# Altium schematic sheet QCopterFC__Sch.SchDoc
size A4; PageSetup: Record=PageOptions|CenterHorizontal=True|CenterVertical=True|PrintScale=1.00|XCorrection=1.00|YCorrection=1.00|PrintKind=0|BorderSize=5000000|LeftOffset=0|BottomOffset=0|Orientation=2|PaperLength=1000|PaperWidth=1000|Scale=100|PaperSource=7|PrintQuality=-4|MediaType=1|DitherType=10|PaperKind=A4|PrintScaleMode=1
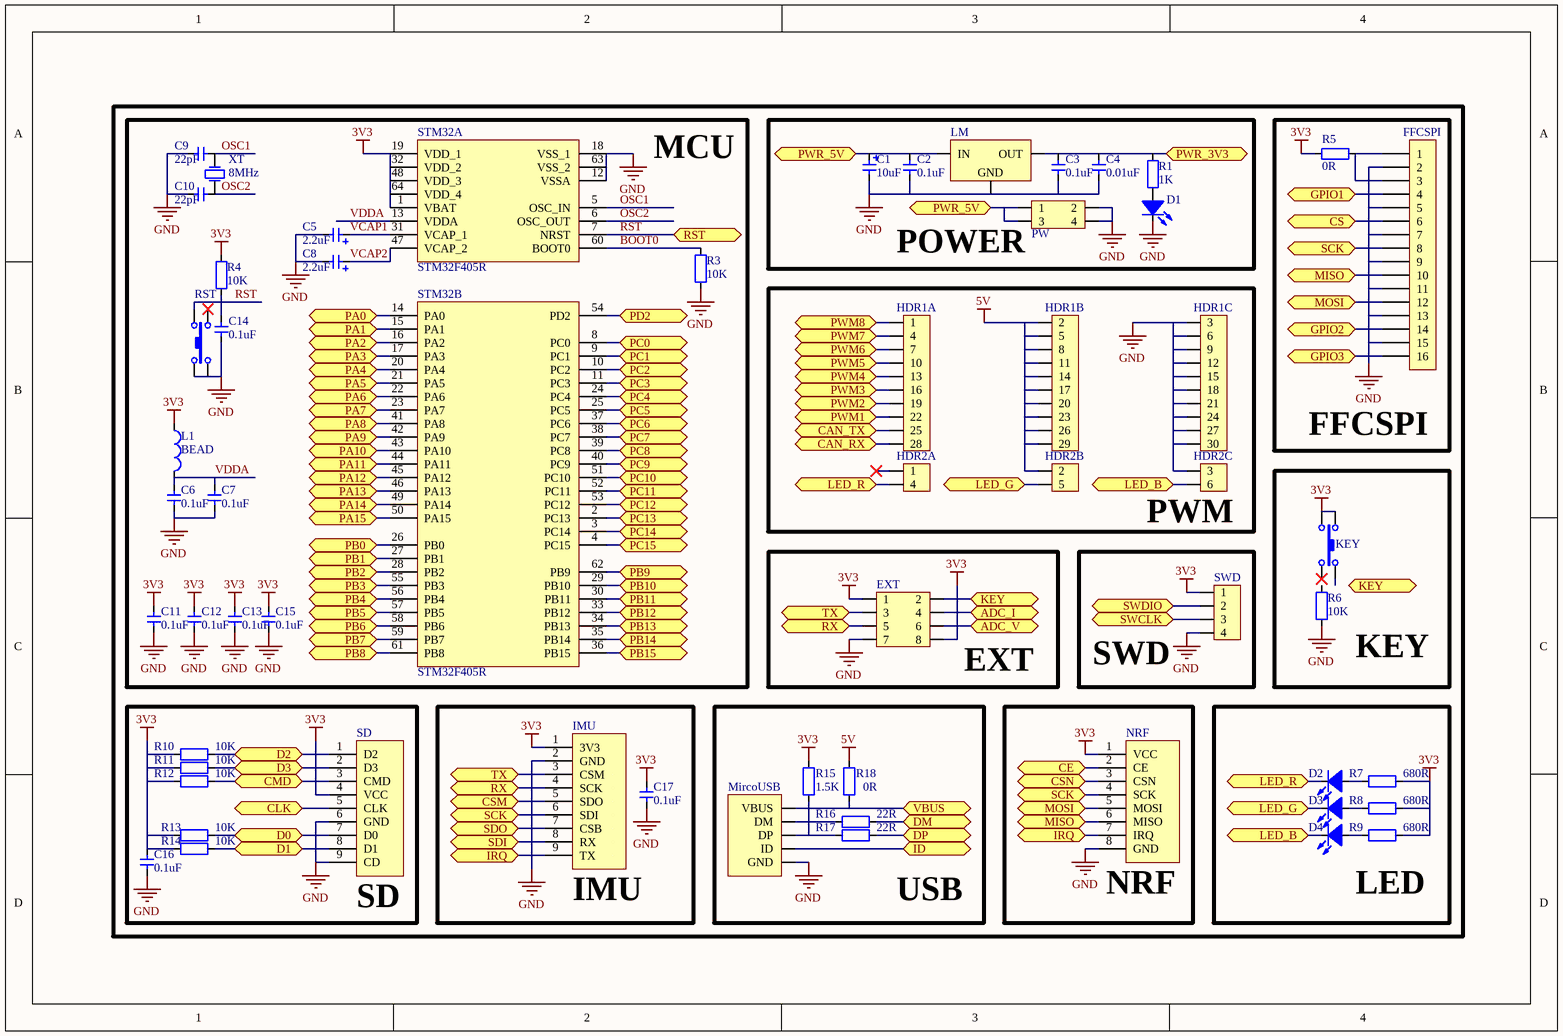
[diagram p0: QCopterFC__Sch.SchDoc]

## Parts
C1  value 10uF  [CAP_TAN_B1210]  (hidden comment: Cap_Tan_1210)
C2  value 0.1uF  [CAP_0603]  (hidden comment: Cap_0603)
C3  value 0.1uF  [CAP_0603]  (hidden comment: Cap_0603)
C4  value 0.01uF  [CAP_0603]  (hidden comment: Cap_0603)
C5  value 2.2uF  [CAP_TAN_P0805]  (hidden comment: Cap_Tan_0805)
C6  value 0.1uF  [CAP_0603]  (hidden comment: Cap_0603)
C7  value 0.1uF  [CAP_0603]  (hidden comment: Cap_0603)
C8  value 2.2uF  [CAP_TAN_P0805]  (hidden comment: Cap_Tan_0805)
C9  value 22pF  [CAP_0603]  (hidden comment: Cap_0603)
C10  value 22pF  [CAP_0603]  (hidden comment: Cap_0603)
C11  value 0.1uF  [CAP_0603]  (hidden comment: Cap_0603)
C12  value 0.1uF  [CAP_0603]  (hidden comment: Cap_0603)
C13  value 0.1uF  [CAP_0603]  (hidden comment: Cap_0603)
C14  value 0.1uF  [CAP_0603]  (hidden comment: Cap_0603)
C15  value 0.1uF  [CAP_0603]  (hidden comment: Cap_0603)
C16  value 0.1uF  [CAP_0603]  (hidden comment: Cap_0603)
C17  value 0.1uF  [CAP_0603]  (hidden comment: Cap_0603)
D1  LED_0603  [LED_0603_WHITE]  (value not drawn)
D2  LED_0603  [LED_0603_RED]  (value not drawn)
D3  LED_0603  [LED_0603_GREEN]  (value not drawn)
D4  LED_0603  [LED_0603_BLUE]  (value not drawn)
EXT  HDR2X4_90_2.54  [HDR2X4_90_2.54]  (value not drawn)
FFCSPI  FFC_0.5_16  [FFC_0.5_16]  (value not drawn)
HDR1  HDR3X10_90_2.54  [HDR3X10_90_2.54]  (value not drawn)  (parts A,B,C of 3)
HDR2  HDR3X2_90_2.54  [HDR3X2_90_2.54]  (value not drawn)  (parts A,B,C of 3)
IMU  SmartIMU  [SMART_IMU]  (value not drawn)
KEY  BT_TACT_3.5*5_90  [BT_TACT_3.5*3.55_90]  (value not drawn)
L1  value BEAD  [IND_0603]  (hidden comment: Ind_0603)
LM  LM1117  [SOT223]  (value not drawn)
MircoUSB  USB_Micro  [USB_Micro-AB]  (value not drawn)
NRF  nRF24L01P_PA_LNA  [NRF24L01P_PA_LNA]  (value not drawn)
PW  HDR2X2_90_2.54  [HDR2X2_90_2.54]  (value not drawn)
R1  value 1K  [RES_0603]  (hidden comment: Res_0603)
R3  value 10K  [RES_0603]  (hidden comment: Res_0603)
R4  value 10K  [RES_0603]  (hidden comment: Res_0603)
R5  value 0R  [RES_0603]  (hidden comment: Res_0603)
R6  value 10K  [RES_0603]  (hidden comment: Res_0603)
R7  value 680R  [RES_0603]  (hidden comment: Res_0603)
R8  value 680R  [RES_0603]  (hidden comment: Res_0603)
R9  value 680R  [RES_0603]  (hidden comment: Res_0603)
R10  value 10K  [RES_0603]  (hidden comment: Res_0603)
R11  value 10K  [RES_0603]  (hidden comment: Res_0603)
R12  value 10K  [RES_0603]  (hidden comment: Res_0603)
R13  value 10K  [RES_0603]  (hidden comment: Res_0603)
R14  value 10K  [RES_0603]  (hidden comment: Res_0603)
R15  value 1.5K  [RES_0603]  (hidden comment: Res_0603)
R16  value 22R  [RES_0603]  (hidden comment: Res_0603)
R17  value 22R  [RES_0603]  (hidden comment: Res_0603)
R18  value 0R  [RES_0603]  (hidden comment: Res_0603)
RST  BT_TACT_3.5*5_90  [BT_TACT_3.5*3.55_90]  (value not drawn)
SD  SD_Card_TF  [SD_Card_TF]  (value not drawn)
STM32  STM32F405R  [STM32_QFP64]  (parts A,B of 2)
SWD  HDR1X4_90F_2.54  [HDR1X4_90F_2.54]  (value not drawn)
XT  value 8MHz  [XTAL_5032]  (hidden comment: XTAL_5032_2P)

## Blocks framed on the sheet
MCU: C5-C15 L1 R3 R4 RST STM32 XT
POWER: C1-C4 D1 LM PW R1
FFCSPI: FFCSPI R5
PWM: HDR1 HDR2
KEY: KEY R6
SWD: SWD
IMU: C17 IMU
USB: MircoUSB R15-R18
NRF: NRF
LED: D2-D4 R7-R9

## Ports
ADC_I, ADC_V, CAN_RX, CAN_TX, CE, CLK, CMD, CS, CSM, CSN, D0, D1, D2, D3, DM, DP, GPIO1, GPIO2, GPIO3, ID, IRQ, KEY, LED_B, LED_G, LED_R, MISO, MOSI, PA0, PA1, PA2, PA3, PA4, PA5, PA6, PA7, PA8, PA9, PA10, PA11, PA12, PA13, PA14, PA15, PB0, PB1, PB2, PB3, PB4, PB5, PB6, PB7, PB8, PB9, PB10, PB11, PB12, PB13, PB14, PB15, PC0, PC1, PC2, PC3, PC4, PC5, PC6, PC7, PC8, PC9, PC10, PC11, PC12, PC13, PC14, PC15, PD2, PWM1, PWM2, PWM3, PWM4, PWM5, PWM6, PWM7, PWM8, PWR_3V3, PWR_5V, RST, RX, SCK, SDI, SDO, SWCLK, SWDIO, TX, VBUS

## Nets
3V3: C11.1 C12.1 C13.1 C15.1 C16.2 C17.2 EXT.1 EXT.8 IMU.1(3V3) KEY.1 KEY.3 L1.1 NRF.1(VCC) R4.2 R5.1 R7.1 R8.1 R9.1 R10.2 R11.2 R12.2 R13.2 R14.2 R15.2 SD.4(VCC) STM32.1(VBAT) STM32.19(VDD_1) STM32.32(VDD_2) STM32.48(VDD_3) STM32.64(VDD_4) SWD.1
5V: HDR1.2 HDR1.5 HDR1.8 HDR1.11 HDR1.14 HDR1.17 HDR1.20 HDR1.23 HDR1.26 HDR1.29 HDR2.2 R18.2
GND: C1.2 C2.1 C3.1 C4.1 C5.2 C6.1 C7.1 C8.2 C9.1 C10.1 C11.2 C12.2 C13.2 C14.2 C15.2 C16.1 C17.1 D1.2(K) EXT.7 FFCSPI.2 FFCSPI.5 FFCSPI.7 FFCSPI.9 FFCSPI.11 FFCSPI.13 FFCSPI.15 HDR1.3 HDR1.6 HDR1.9 HDR1.12 HDR1.15 HDR1.18 HDR1.21 HDR1.24 HDR1.27 HDR1.30 HDR2.3 IMU.2(GND) LM.1(GND) MircoUSB.5(GND) NRF.8(GND) PW.2 PW.4 R3.1 R6.1 RST.1 RST.3 SD.6(GND) SD.9(CD) STM32.12(VSSA) STM32.18(VSS_1) STM32.63(VSS_2) SWD.4
ADC_I: EXT.4 ; port ADC_I
ADC_V: EXT.6 ; port ADC_V
BOOT0: R3.2 STM32.60(BOOT0)
CAN_RX: HDR1.28 ; port CAN_RX
CAN_TX: HDR1.25 ; port CAN_TX
CE: NRF.2(CE) ; port CE
CLK: SD.5(CLK) ; port CLK
CMD: R12.1 SD.3(CMD) ; port CMD
CS: FFCSPI.6 ; port CS
CSM: IMU.5(SDO) ; port CSM
CSN: NRF.3(CSN) ; port CSN
D0: R13.1 SD.7(D0) ; port D0
D1: R14.1 SD.8(D1) ; port D1
D2: R10.1 SD.1(D2) ; port D2
D3: R11.1 SD.2(D3) ; port D3
DM: R16.1 ; port DM
DP: R17.1 ; port DP
GPIO1: FFCSPI.4 ; port GPIO1
GPIO2: FFCSPI.14 ; port GPIO2
GPIO3: FFCSPI.16 ; port GPIO3
ID: MircoUSB.4(ID) ; port ID
IRQ: IMU.9(TX) NRF.7(IRQ) ; port IRQ
KEY: EXT.2 ; port KEY
LED_B: D4.2(K) HDR2.6 ; port LED_B
LED_G: D3.2(K) HDR2.5 ; port LED_G
LED_R: D2.2(K) HDR2.4 ; port LED_R
MISO: FFCSPI.10 NRF.6(MISO) ; port MISO
MOSI: FFCSPI.12 NRF.5(MOSI) ; port MOSI
OSC1: C9.2 STM32.5(OSC_IN) XT.2(OSC2)
OSC2: C10.2 STM32.6(OSC_OUT) XT.1(OSC1)
PA0: STM32.14(PA0) ; port PA0
PA1: STM32.15(PA1) ; port PA1
PA2: STM32.16(PA2) ; port PA2
PA3: STM32.17(PA3) ; port PA3
PA4: STM32.20(PA4) ; port PA4
PA5: STM32.21(PA5) ; port PA5
PA6: STM32.22(PA6) ; port PA6
PA7: STM32.23(PA7) ; port PA7
PA8: STM32.41(PA8) ; port PA8
PA9: STM32.42(PA9) ; port PA9
PA10: STM32.43(PA10) ; port PA10
PA11: STM32.44(PA11) ; port PA11
PA12: STM32.45(PA12) ; port PA12
PA13: STM32.46(PA13) ; port PA13
PA14: STM32.49(PA14) ; port PA14
PA15: STM32.50(PA15) ; port PA15
PB0: STM32.26(PB0) ; port PB0
PB1: STM32.27(PB1) ; port PB1
PB2: STM32.28(PB2) ; port PB2
PB3: STM32.55(PB3) ; port PB3
PB4: STM32.56(PB4) ; port PB4
PB5: STM32.57(PB5) ; port PB5
PB6: STM32.58(PB6) ; port PB6
PB7: STM32.59(PB7) ; port PB7
PB8: STM32.61(PB8) ; port PB8
PB9: STM32.62(PB9) ; port PB9
PB10: STM32.29(PB10) ; port PB10
PB11: STM32.30(PB11) ; port PB11
PB12: STM32.33(PB12) ; port PB12
PB13: STM32.34(PB13) ; port PB13
PB14: STM32.35(PB14) ; port PB14
PB15: STM32.36(PB15) ; port PB15
PC0: STM32.8(PC0) ; port PC0
PC1: STM32.9(PC1) ; port PC1
PC2: STM32.10(PC2) ; port PC2
PC3: STM32.11(PC3) ; port PC3
PC4: STM32.24(PC4) ; port PC4
PC5: STM32.25(PC5) ; port PC5
PC6: STM32.37(PC6) ; port PC6
PC7: STM32.38(PC7) ; port PC7
PC8: STM32.39(PC8) ; port PC8
PC9: STM32.40(PC9) ; port PC9
PC10: STM32.51(PC10) ; port PC10
PC11: STM32.52(PC11) ; port PC11
PC12: STM32.53(PC12) ; port PC12
PC13: STM32.2(PC13) ; port PC13
PC14: STM32.3(PC14) ; port PC14
PC15: STM32.4(PC15) ; port PC15
PD2: STM32.54(PD2) ; port PD2
PWM1: HDR1.22 ; port PWM1
PWM2: HDR1.19 ; port PWM2
PWM3: HDR1.16 ; port PWM3
PWM4: HDR1.13 ; port PWM4
PWM5: HDR1.10 ; port PWM5
PWM6: HDR1.7 ; port PWM6
PWM7: HDR1.4 ; port PWM7
PWM8: HDR1.1 ; port PWM8
PWR_3V3: C3.2 C4.2 LM.2(OUT) R1.2 ; port PWR_3V3
PWR_5V: C1.1 C2.2 LM.3(IN) PW.1 PW.3 ; port PWR_5V
RST: C14.1 R4.1 RST.2 STM32.7(NRST) ; port RST
RX: EXT.5 IMU.4(SCK) ; port RX
SCK: FFCSPI.8 IMU.6(SDI) NRF.4(SCK) ; port SCK
SDI: IMU.8(RX) ; port SDI
SDO: IMU.7(CSB) ; port SDO
SWCLK: SWD.3 ; port SWCLK
SWDIO: SWD.2 ; port SWDIO
TX: EXT.3 IMU.3(CSM) ; port TX
VBUS: MircoUSB.1(VBUS) R18.1 ; port VBUS
VCAP1: C5.1 STM32.31(VCAP_1)
VCAP2: C8.1 STM32.47(VCAP_2)
VDDA: C6.2 C7.2 L1.2 STM32.13(VDDA)
NetD1_1: D1.1(A) R1.1
NetD2_1: D2.1(A) R7.2
NetD3_1: D3.1(A) R8.2
NetD4_1: D4.1(A) R9.2
NetFFCSPI_1: FFCSPI.1 FFCSPI.3 R5.2
NetMircoUSB_2: MircoUSB.2(DM) R16.2
NetMircoUSB_3: MircoUSB.3(DP) R15.1 R17.2

Not connected (* = marked no-connect by the designer): HDR2 1*; IMU 10(NC) 11(NC) 12(NC) 13(NC) 14(NC) 15(NC) 16(NC); KEY 2 4*; R6 2; RST 4*

## Notes on the sheet
- Labels drawn without touching a wire or pin: EXT, SD

## Library data of the parts
C1 = Cap_Tan_1210: Capacitor
C2-C4 C6 C7 C9-C17 = Cap_0603: Capacitor
C5 C8 = Cap_Tan_0805: Capacitor
D1-D4 = LED_0603: LED
EXT = HDR2X4_90_2.54: Header
FFCSPI = FFC_0.5_16: FFC
HDR1 = HDR3X10_90_2.54: Header
HDR2 = HDR3X2_90_2.54: Header
IMU = SmartIMU: Module
KEY RST = BT_TACT_3.5*5_90: Switch
L1 = Ind_0603: Inductor
LM = LM1117: Power
MircoUSB = USB_Micro: USB
NRF = nRF24L01P_PA_LNA: Module
PW = HDR2X2_90_2.54: Header
R1 R3-R18 = Res_0603: Resistor
SD = SD_Card_TF: SD
STM32 = STM32F405R: MCU
SWD = HDR1X4_90F_2.54: Header
XT = XTAL_5032_2P: Crystal Oscillator